# EAGLE design DelayExperiments (EAGLE 7.7.0)
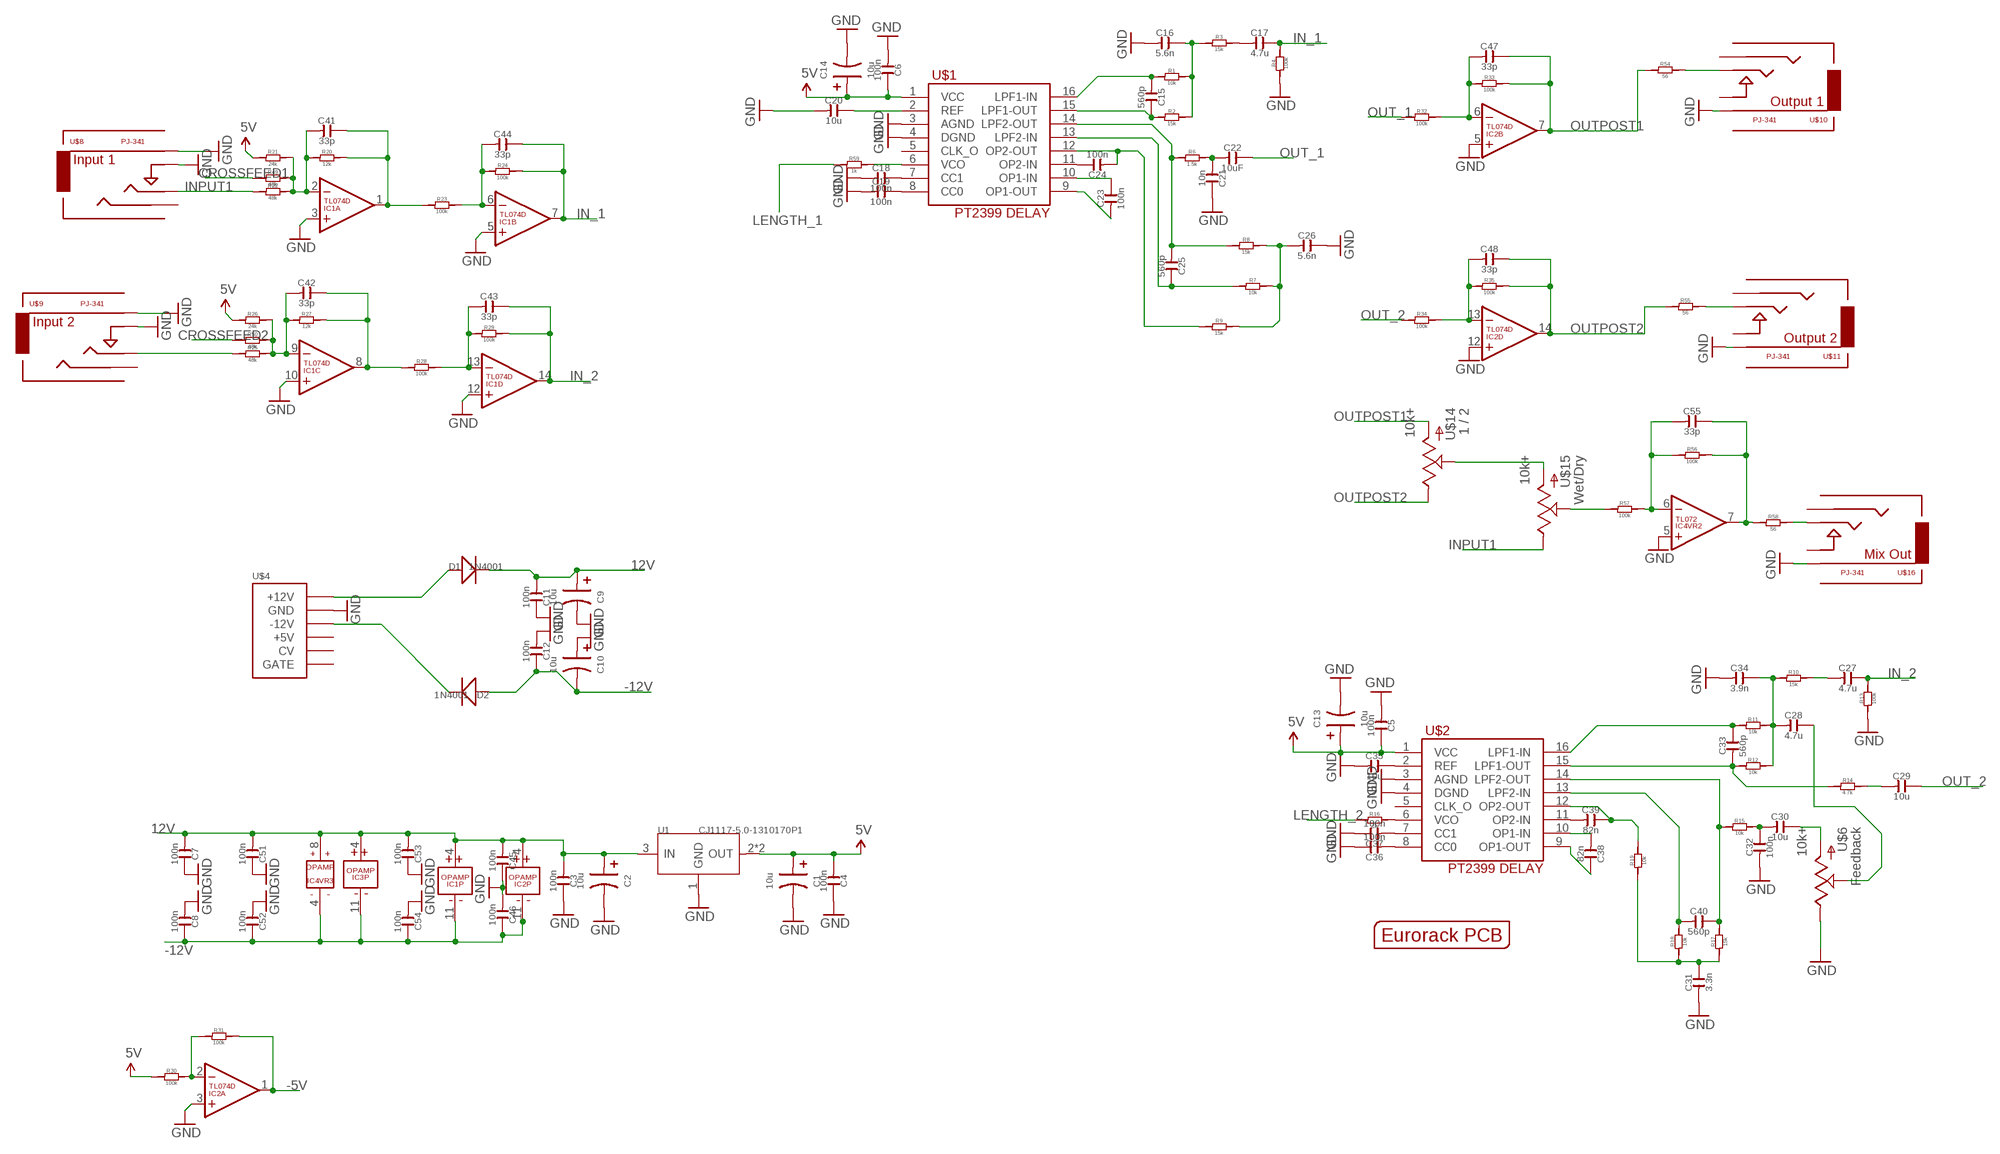
[diagram p0: schematic, sheet 1, part 1 of 2]
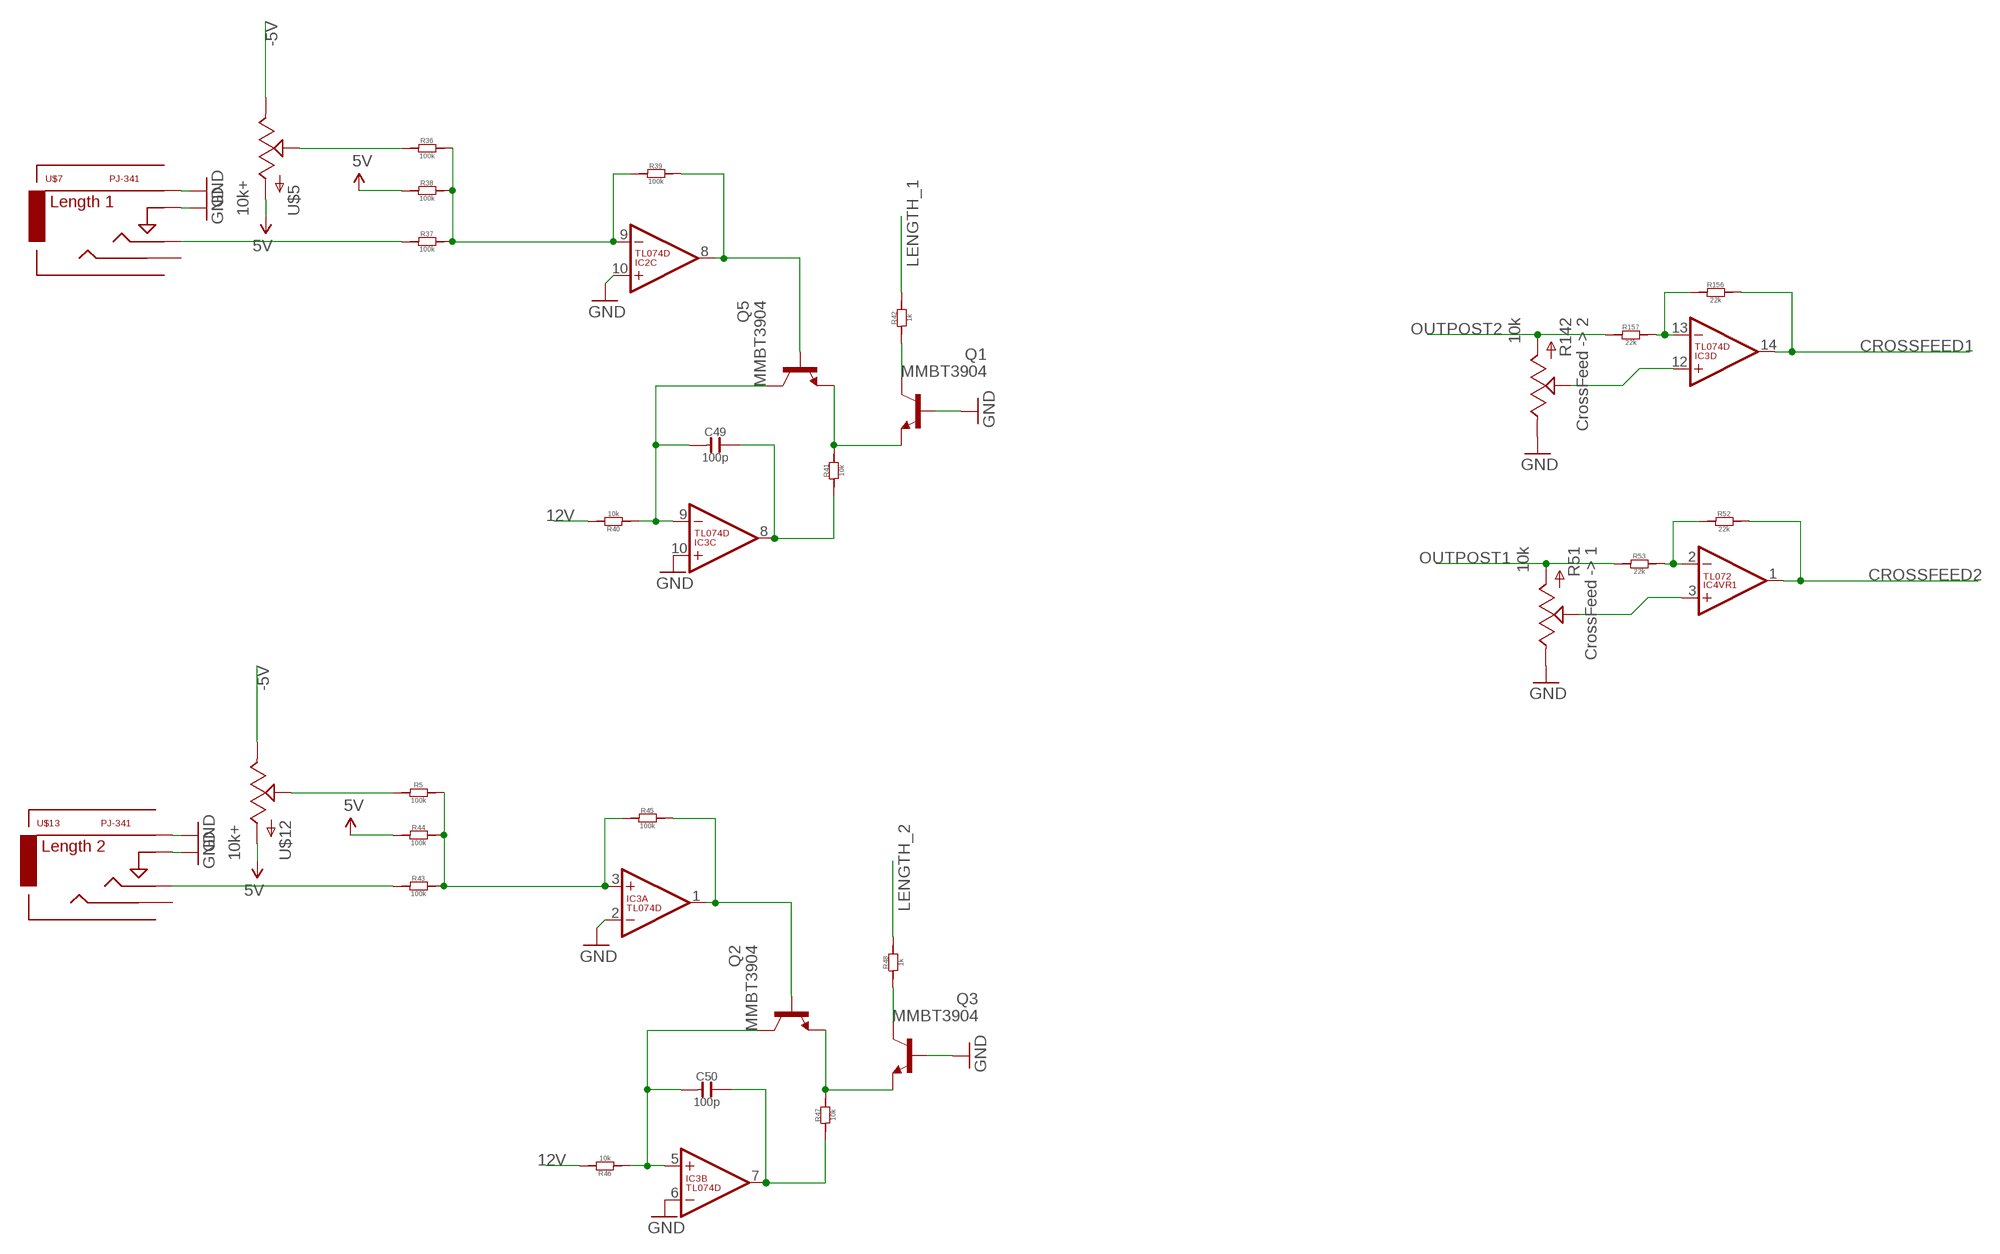
[diagram p1: schematic, sheet 1, part 2 of 2]

## Parts
C1  10u  C-POLAR-A  [CASE-A_3216]
C2  10u  C-POLAR-A  [CASE-A_3216]
C3  100n  C-0603  [C0603]
C4  100n  C-0603  [C0603]
C5  100n  C-0603  [C0603]
C6  100n  C-0603  [C0603]
C7  100n  C-0603  [C0603]
C8  100n  C-0603  [C0603]
C9  10u  C-POLAR-A  [CASE-A_3216]
C10  10u  C-POLAR-A  [CASE-A_3216]
C11  100n  C-0603  [C0603]
C12  100n  C-0603  [C0603]
C13  10u  C-POLAR-A  [CASE-A_3216]
C14  10u  C-POLAR-A  [CASE-A_3216]
C15  560p  C-0603  [C0603]
C16  5.6n  C-0603  [C0603]
C17  4.7u  C-0603  [C0603]
C18  100n  C-0603  [C0603]
C19  100n  C-0603  [C0603]
C20  10u  C-0603  [C0603]
C21  10n  C-0603  [C0603]
C22  10uF  C-0603  [C0603]
C23  100n  C-0603  [C0603]
C24  100n  C-0603  [C0603]
C25  560p  C-0603  [C0603]
C26  5.6n  C-0603  [C0603]
C27  4.7u  C-0603  [C0603]
C28  4.7u  C-0603  [C0603]
C29  10u  C-0603  [C0603]
C30  10u  C-0603  [C0603]
C31  3.3n  C-0603  [C0603]
C32  100n  C-0603  [C0603]
C33  560p  C-0603  [C0603]
C34  3.9n  C-0603  [C0603]
C35  10u  C-0603  [C0603]
C36  100n  C-0603  [C0603]
C37  100n  C-0603  [C0603]
C38  82n  C-0603  [C0603]
C39  82n  C-0603  [C0603]
C40  560p  C-0603  [C0603]
C41  33p  C-0603  [C0603]
C42  33p  C-0603  [C0603]
C43  33p  C-0603  [C0603]
C44  33p  C-0603  [C0603]
C45  100n  C-0603  [C0603]
C46  100n  C-0603  [C0603]
C47  33p  C-0603  [C0603]
C48  33p  C-0603  [C0603]
C49  100p  C-0603  [C0603]
C50  100p  C-0603  [C0603]
C51  100n  C-0603  [C0603]
C52  100n  C-0603  [C0603]
C53  100n  C-0603  [C0603]
C54  100n  C-0603  [C0603]
C55  33p  C-0603  [C0603]
D1  1N4001  D-SOD-123  [SOD123]
D2  1N4001  D-SOD-123  [SOD123]
IC1  TL074D  [SO14]
IC2  TL074D  [SO14]
IC3  TL074D  [SO14]
IC4  TL072  [SO08]
Q1  MMBT3904  MMBT3904LT1-NPN-SOT23-BEC  [SOT23-BEC]
Q2  MMBT3904  MMBT3904LT1-NPN-SOT23-BEC  [SOT23-BEC]
Q3  MMBT3904  MMBT3904LT1-NPN-SOT23-BEC  [SOT23-BEC]
Q5  MMBT3904  MMBT3904LT1-NPN-SOT23-BEC  [SOT23-BEC]
R1  10k  R-0603  [R0603]
R2  15k  R-0603  [R0603]
R3  15k  R-0603  [R0603]
R4  100k  R-0603  [R0603]
R5  100k  R-0603  [R0603]
R6  1.5k  R-0603  [R0603]
R7  10k  R-0603  [R0603]
R8  15k  R-0603  [R0603]
R9  15k  R-0603  [R0603]
R10  15k  R-0603  [R0603]
R11  10k  R-0603  [R0603]
R12  10k  R-0603  [R0603]
R13  100k  R-0603  [R0603]
R14  4.7k  R-0603  [R0603]
R15  10k  R-0603  [R0603]
R16  1k  R-0603  [R0603]
R17  15k  R-0603  [R0603]
R18  10k  R-0603  [R0603]
R19  10k  R-0603  [R0603]
R20  12k  R-0603  [R0603]
R21  24k  R-0603  [R0603]
R22  48k  R-0603  [R0603]
R23  100k  R-0603  [R0603]
R24  100k  R-0603  [R0603]
R25  48k  R-0603  [R0603]
R26  24k  R-0603  [R0603]
R27  12k  R-0603  [R0603]
R28  100k  R-0603  [R0603]
R29  100k  R-0603  [R0603]
R30  100k  R-0603  [R0603]
R31  100k  R-0603  [R0603]
R32  100k  R-0603  [R0603]
R33  100k  R-0603  [R0603]
R34  100k  R-0603  [R0603]
R35  100k  R-0603  [R0603]
R36  100k  R-0603  [R0603]
R37  100k  R-0603  [R0603]
R38  100k  R-0603  [R0603]
R39  100k  R-0603  [R0603]
R40  10k  R-0603  [R0603]
R41  10k  R-0603  [R0603]
R42  1k  R-0603  [R0603]
R43  100k  R-0603  [R0603]
R44  100k  R-0603  [R0603]
R45  100k  R-0603  [R0603]
R46  10k  R-0603  [R0603]
R47  10k  R-0603  [R0603]
R48  1k  R-0603  [R0603]
R49  48k  R-0603  [R0603]
R50  48k  R-0603  [R0603]
R51  10k  POTZEPHPOT  [OG-POTS_ALPS_POT_VERTICAL]
R52  22k  R-0603  [R0603]
R53  22k  R-0603  [R0603]
R54  56  R-0603  [R0603]
R55  56  R-0603  [R0603]
R56  100k  R-0603  [R0603]
R57  100k  R-0603  [R0603]
R58  56  R-0603  [R0603]
R59  1k  R-0603  [R0603]
R142  10k  POTZEPHPOT  [OG-POTS_ALPS_POT_VERTICAL]
R156  22k  R-0603  [R0603]
R157  22k  R-0603  [R0603]
U1  CJ1117-5.0-1310170P1  [SOT223]
U$1  PT2399  [SO16]
U$2  PT2399  [SO16]
U$3  EURORACK_PCB12HP  [EURORACK12HPPCB]
U$4  POWERSHROUDED  [POWER_16_SHROUDED]
U$5  10k+  POTZEPHPOT_BIGKNOB  [OG-POTS_ALPS_POT_VERTICAL_WITHBIGKNOB]
U$6  10k+  POTZEPHPOT  [OG-POTS_ALPS_POT_VERTICAL]
U$7  PJ-341  AUDIO-JACKINPUT  [3.5MM-JACK-SWITCH-13MM-INPUT]
U$8  PJ-341  AUDIO-JACKINPUT  [3.5MM-JACK-SWITCH-13MM-INPUT]
U$9  PJ-341  AUDIO-JACKINPUT  [3.5MM-JACK-SWITCH-13MM-INPUT]
U$10  PJ-341  AUDIO-JACKOUTPUT  [3.5MM-JACK-SWITCH-13MM-OUTPUT]
U$11  PJ-341  AUDIO-JACKOUTPUT  [3.5MM-JACK-SWITCH-13MM-OUTPUT]
U$12  10k+  POTZEPHPOT_BIGKNOB  [OG-POTS_ALPS_POT_VERTICAL_WITHBIGKNOB]
U$13  PJ-341  AUDIO-JACKINPUT  [3.5MM-JACK-SWITCH-13MM-INPUT]
U$14  10k+  POTZEPHPOT  [OG-POTS_ALPS_POT_VERTICAL]
U$15  10k+  POTZEPHPOT  [OG-POTS_ALPS_POT_VERTICAL]
U$16  PJ-341  AUDIO-JACKOUTPUT  [3.5MM-JACK-SWITCH-13MM-OUTPUT]

## Nets
5V [heavypower]: C1.+ C4.1 C5.2 C6.2 C13.+ C14.+ R21.1 R26.1 R30.1 R38.1 R44.1 U1.2(OUT) U1.TER(OUT) U$1.1(VCC) U$2.1(VCC) U$5.P$3(A) U$12.P$3(A)
12V [heavypower]: C2.+ C3.1 C7.1 C9.+ C11.1 C45.1 C51.1 C53.1 D1.- IC1.4(P:V+) IC2.4(P:V+) IC3.4(P:V+) IC4.8(VR3:V+) R40.2 R46.2 U1.3(IN)
-5V: IC2.1(A:OUT) R31.2 U$5.P$1(E) U$12.P$1(E)
-12V [heavypower]: C8.2 C10.- C12.2 C46.2 C52.2 C54.2 D2.+ IC1.11(P:V-) IC2.11(P:V-) IC3.11(P:V-) IC4.4(VR3:V-)
CROSSFEED1: IC3.14(D:OUT) R49.1 R156.2
CROSSFEED2: IC4.1(VR1:OUT) R50.1 R52.2
GND [groundplane]: C1.- C2.- C3.2 C4.2 C5.1 C6.1 C7.2 C8.1 C9.- C10.+ C11.2 C12.1 C13.- C14.- C16.1 C18.1 C19.1 C20.1 C21.2 C26.2 C31.1 C32.1 C34.1 C35.1 C36.2 C37.2 C45.2 C46.1 C51.2 C52.1 C53.2 C54.1 IC1.3(A:+IN) IC1.5(B:+IN) IC1.10(C:+IN) IC1.12(D:+IN) IC2.3(A:+IN) IC2.5(B:+IN) IC2.10(C:+IN) IC2.12(D:+IN) IC3.2(A:-IN) IC3.6(B:-IN) IC3.10(C:+IN) IC4.5(VR2:+IN) Q1.B Q3.B R4.1 R13.1 R51.P$1(E) R142.P$1(E) U1.1(GND) U$1.3(AGND) U$1.4(DGND) U$2.3(AGND) U$2.4(DGND) U$4.3(GND) U$4.4(GND) U$4.5(GND) U$4.6(GND) U$4.7(GND) U$4.8(GND) U$6.P$1(E) U$7.RING@3(RING) U$7.SWITCH@3(SWITCH) U$8.RING@3(RING) U$8.SWITCH@3(SWITCH) U$9.RING@3(RING) U$9.SWITCH@3(SWITCH) U$10.RING@3(RING) U$11.RING@3(RING) U$13.RING@3(RING) U$13.SWITCH@3(SWITCH) U$16.RING@3(RING)
IN_1: C17.2 C44.2 IC1.7(B:OUT) R4.2 R24.2
IN_2: C27.2 C43.2 IC1.14(D:OUT) R13.2 R29.2
INPUT1: R22.1 U$8.TIP@3(TIP) U$15.P$1(E)
LENGTH_1: R42.2 R59.1
LENGTH_2: R16.1 R48.2
N$1 [heavypower]: D1.+ U$4.9(+12V) U$4.10(+12V)
N$2: C15.1 R1.1 U$1.16(LPF1-IN)
N$3: C15.2 R2.1 U$1.15(LPF1-OUT)
N$4: C17.1 R3.2
N$5 [heavypower]: D2.- U$4.1(-12V) U$4.2(-12V)
N$6: C18.2 U$1.7(CC1)
N$7: C16.2 R1.2 R2.2 R3.1
N$8: C19.2 U$1.8(CC0)
N$9: C20.2 U$1.2(REF)
N$10: C21.1 C22.1 R6.2
N$11: R36.1 U$5.P$2(S)
N$12: R5.1 U$12.P$2(S)
N$13: C25.1 R6.1 R8.1 U$1.14(LPF2-OUT)
N$14: C24.2 U$1.11(OP2-IN)
N$15: C23.2 U$1.10(OP1-IN)
N$16: C23.1 U$1.9(OP1-OUT)
N$17: C25.2 R7.1 U$1.13(LPF2-IN)
N$18: C26.1 R7.2 R8.2 R9.2
N$19: C24.1 R9.1 U$1.12(OP2-OUT)
N$20: C28.2 U$6.P$2(S)
N$21: C27.1 R10.2
N$22: C33.1 R12.1 R14.1 U$2.15(LPF1-OUT)
N$23: C33.2 R11.1 U$2.16(LPF1-IN)
N$24: C28.1 C34.2 R10.1 R11.2 R12.2
N$25: C30.2 U$6.P$3(A)
N$26: C29.1 R14.2
N$27: C30.1 C32.2 R15.2
N$28: C40.2 R15.1 R17.2 U$2.14(LPF2-OUT)
N$29: C35.2 U$2.2(REF)
N$30: C36.1 U$2.8(CC0)
N$31: C37.1 U$2.7(CC1)
N$32: R16.2 U$2.6(VCO)
N$33: R37.1 U$7.TIP@3(TIP)
N$34: C38.1 U$2.10(OP1-IN)
N$35: C38.2 U$2.9(OP1-OUT)
N$36: C39.1 U$2.11(OP2-IN)
N$37: C39.2 R19.2 U$2.12(OP2-OUT)
N$38: C40.1 R18.2 U$2.13(LPF2-IN)
N$39: C31.2 R17.1 R18.1 R19.1
N$40: C43.1 IC1.13(D:-IN) R28.2 R29.1
N$41: C44.1 IC1.6(B:-IN) R23.2 R24.1
N$42: C41.1 IC1.2(A:-IN) R20.1 R21.2 R22.2 R49.2
N$43: C41.2 IC1.1(A:OUT) R20.2 R23.1
N$44: IC2.2(A:-IN) R30.2 R31.1
N$45: IC4.2(VR1:-IN) R52.1 R53.2
N$46: C42.2 IC1.8(C:OUT) R27.2 R28.1
N$47: C42.1 IC1.9(C:-IN) R25.2 R26.2 R27.1 R50.2
N$48: R59.2 U$1.6(VCO)
N$49: R25.1 U$9.TIP@3(TIP)
N$50: C47.1 IC2.6(B:-IN) R32.2 R33.1
N$51: C48.1 IC2.13(D:-IN) R34.2 R35.1
N$52: IC2.9(C:-IN) R36.2 R37.2 R38.2 R39.1
N$53: IC2.8(C:OUT) Q5.B R39.2
N$54: C49.1 IC3.9(C:-IN) Q5.C R40.1
N$55: IC4.3(VR1:+IN) R51.P$2(S)
N$56: U$14.P$2(S) U$15.P$3(A)
N$57: Q1.C R42.1
N$58: C49.2 IC3.8(C:OUT) R41.1
N$59: Q1.E Q5.E R41.2
N$60: R43.1 U$13.TIP@3(TIP)
N$61: IC3.3(A:+IN) R5.2 R43.2 R44.2 R45.1
N$62: IC3.1(A:OUT) Q2.B R45.2
N$63: C50.1 IC3.5(B:+IN) Q2.C R46.1
N$64: Q3.C R48.1
N$65: C50.2 IC3.7(B:OUT) R47.1
N$66: Q2.E Q3.E R47.2
N$67: R55.2 U$11.TIP@3(TIP)
N$68: R54.2 U$10.TIP@3(TIP)
N$69: C55.2 IC4.7(VR2:OUT) R56.2 R58.1
N$70: R58.2 U$16.TIP@3(TIP)
N$71: R57.1 U$15.P$2(S)
N$72: IC3.13(D:-IN) R156.1 R157.2
N$73: C55.1 IC4.6(VR2:-IN) R56.1 R57.2
N$78: IC3.12(D:+IN) R142.P$2(S)
OUT_1: C22.2 R32.1
OUT_2: C29.2 R34.1
OUTPOST1: C47.2 IC2.7(B:OUT) R33.2 R51.P$3(A) R53.1 R54.1 U$14.P$3(A)
OUTPOST2: C48.2 IC2.14(D:OUT) R35.2 R55.1 R142.P$3(A) R157.1 U$14.P$1(E)
Unconnected: U$1.5(CLK_O) U$2.5(CLK_O) U$4.11(+5V) U$4.12(+5V) U$4.13(CV) U$4.14(CV) U$4.15(GATE) U$4.16(GATE) U$7.SECOND@3(SECOND) U$8.SECOND@3(SECOND) U$9.SECOND@3(SECOND) U$10.SECOND@3(SECOND) U$10.SWITCH@3(SWITCH) U$11.SECOND@3(SECOND) U$11.SWITCH@3(SWITCH) U$13.SECOND@3(SECOND) U$16.SECOND@3(SECOND) U$16.SWITCH@3(SWITCH)

## Library data of the parts
C1 C2 C9 C10 C13 C14 = EurorackModularParts:C-POLAR*
C3-C8 C11 C12 C15-C55 = OPL:C*
D1 D2 = OPL:D*: DIODE
IC1-IC3 = EurorackModularParts:TL074: OP AMP
IC4 = EurorackModularParts:TL072
Q1-Q3 Q5 = transistor:*-NPN-: NPN Transistror BF959 corrected 2008.03.06; MF: NXP; MPN: PMBT3904,215; OC_FARNELL: 2336795
R1-R50 R52-R59 R156 R157 = OPL:R*
R51 = EurorackModularParts:POT; DESC: CrossFeed -> 1
R142 = EurorackModularParts:POT; DESC: CrossFeed -> 2
U1 = OPL:CJ1117-5.0
U$1 U$2 = EurorackModularParts:PT2399
U$3 = EurorackModularParts:EURORACK_PCB
U$4 = EurorackModularParts:POWER
U$5 U$12 = EurorackModularParts:POT
U$6 = EurorackModularParts:POT; DESC: Feedback
U$7 = EurorackModularParts:AUDIO-JACK: Switching Mono 3.5mm Audio Jack from Erthenvar.; DESC: Length 1; MPN: PJ-341
U$8 = EurorackModularParts:AUDIO-JACK: Switching Mono 3.5mm Audio Jack from Erthenvar.; DESC: Input 1; MPN: PJ-341
U$9 = EurorackModularParts:AUDIO-JACK: Switching Mono 3.5mm Audio Jack from Erthenvar.; DESC: Input 2; MPN: PJ-341
U$10 = EurorackModularParts:AUDIO-JACK: Switching Mono 3.5mm Audio Jack from Erthenvar.; DESC: Output 1; MPN: PJ-341
U$11 = EurorackModularParts:AUDIO-JACK: Switching Mono 3.5mm Audio Jack from Erthenvar.; DESC: Output 2; MPN: PJ-341
U$13 = EurorackModularParts:AUDIO-JACK: Switching Mono 3.5mm Audio Jack from Erthenvar.; DESC: Length 2; MPN: PJ-341
U$14 = EurorackModularParts:POT; DESC: 1 / 2
U$15 = EurorackModularParts:POT; DESC: Wet/Dry
U$16 = EurorackModularParts:AUDIO-JACK: Switching Mono 3.5mm Audio Jack from Erthenvar.; DESC: Mix Out; MPN: PJ-341

## Net classes
0 default: width 0.254 mm
1 heavypower: width 0.381 mm
3 groundplane: width 0.279 mm

## Board
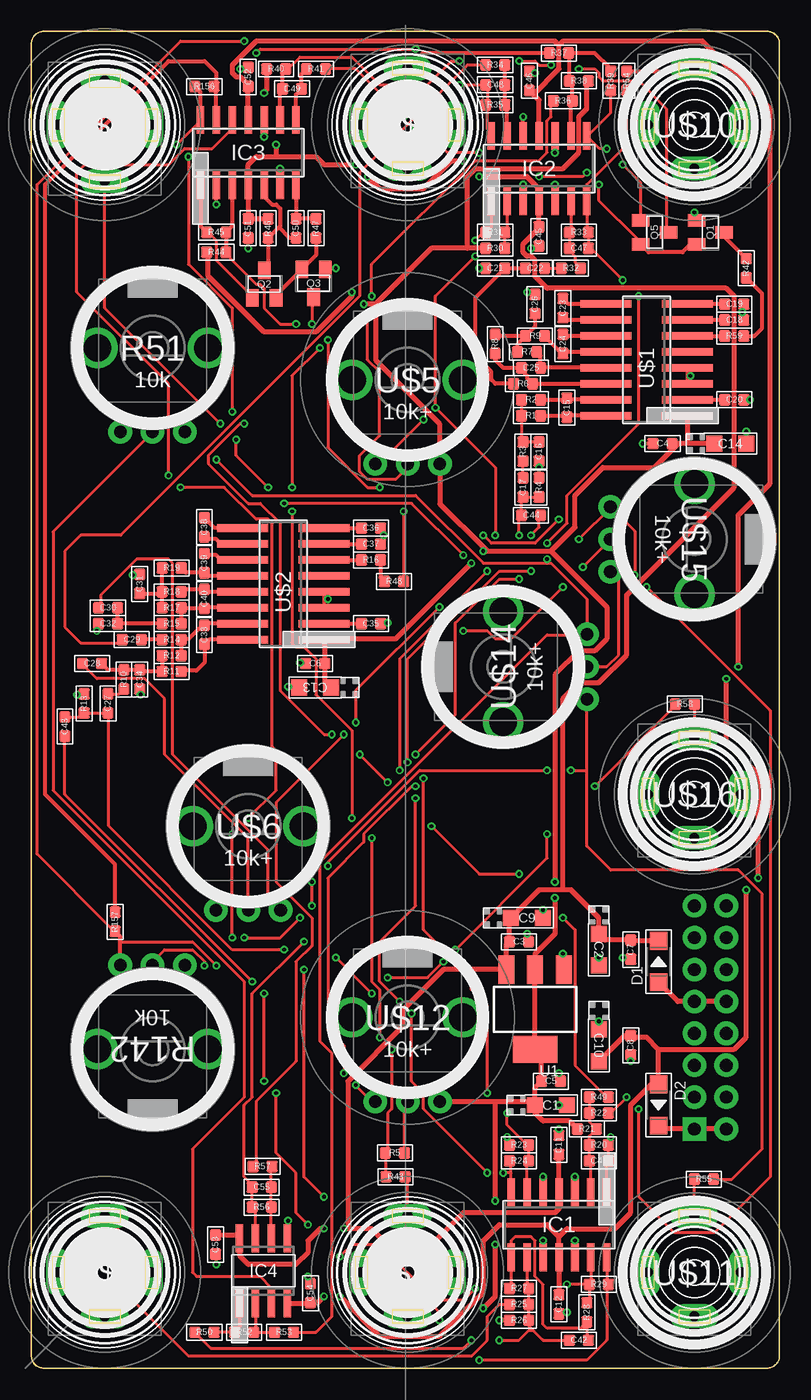
[diagram p2: board, top side]
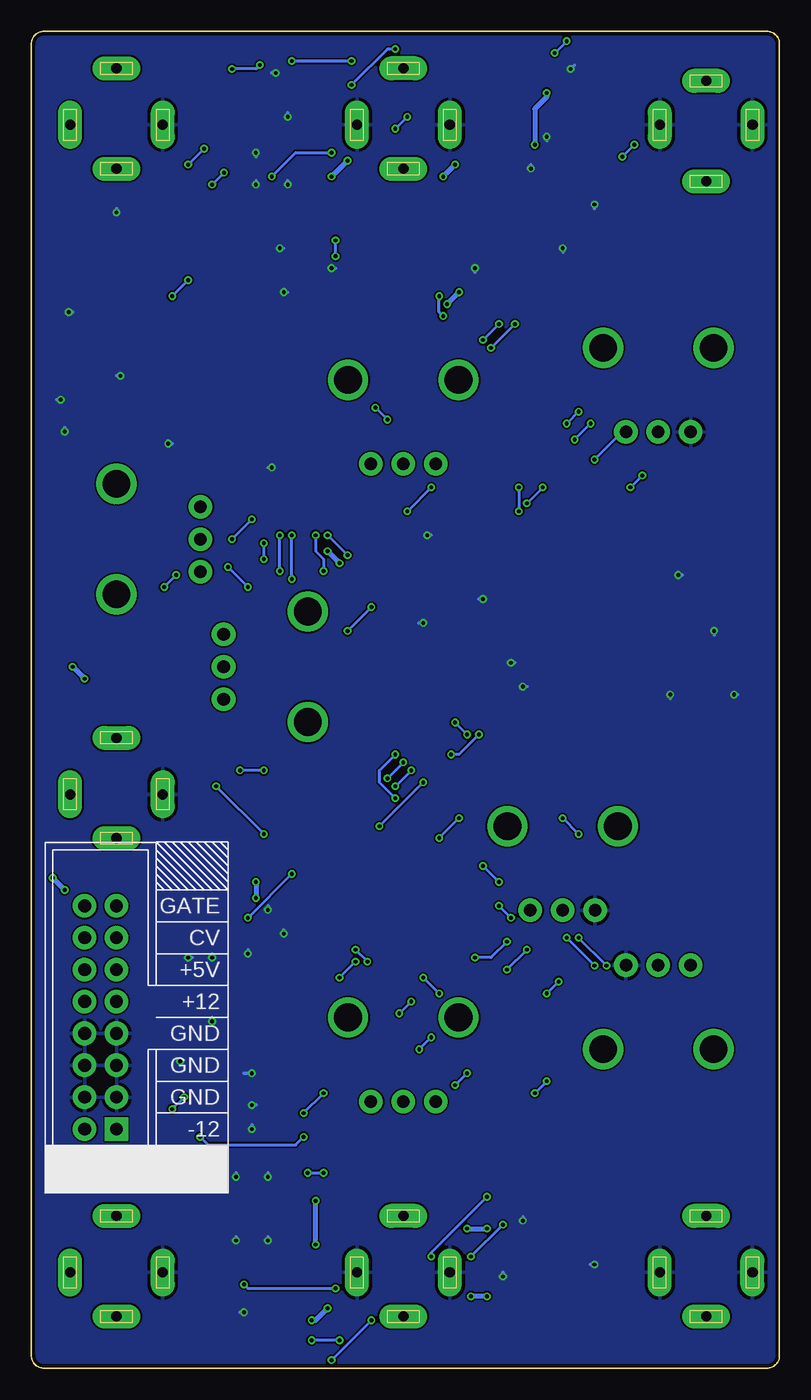
[diagram p3: board, bottom side, seen from below]

Size 59.62 x 106.5 mm. Coordinates in mm from the lower left corner, seen from the top.
Copper layers (1*16): Top 0.035mm / dielectric 1.5mm / Bottom 0.035mm
Design rules "dirt_cheap_dirty_boards.v1": minimum track width 5mil, minimum drill 12mil, track to track 5mil, track to pad 5mil, pad to pad 5mil, via to via 5mil, smd to smd 0mil, copper to edge 10mil, drill to drill 10mil, minimum pad ring 10mil, minimum via ring 6mil, stop-mask expansion 2mil, vias tented up to drill 25mil, thermal gap 10mil

### Footprints (pad centres in the part's own frame; a part is rotated, then mirrored left to right if it is on the bottom)
CASE-A_3216 = smd 1.27 x 1.27: + -1.27,0; - 1.27,0
C0603 = smd 0.889 x 0.889: 1 -0.762,0; 2 0.762,0
SOD123 = smd 1.397 x 1.397: + -1.651,0; - 1.651,0
SO14 = smd 0.6 x 2.2: 1 -3.81,-2.6; 2 -2.54,-2.6; 3 -1.27,-2.6; 4 0,-2.6; 5 1.27,-2.6; 6 2.54,-2.6; 7 3.81,-2.6; 8 3.81,2.6; 9 2.54,2.6; 10 1.27,2.6; 11 0,2.6; 12 -1.27,2.6; 13 -2.54,2.6; 14 -3.81,2.6
SO08 = smd 0.6 x 2.2: 1 -1.905,-2.6; 2 -0.635,-2.6; 3 0.635,-2.6; 4 1.905,-2.6; 5 1.905,2.6; 6 0.635,2.6; 7 -0.635,2.6; 8 -1.905,2.6
SOT23-BEC = smd 1 x 1.4: B -0.95,-1.1; C 0,1.1; E 0.95,-1.1
R0603 = smd 0.889 x 0.889: 1 -0.762,0; 2 0.762,0
OG-POTS_ALPS_POT_VERTICAL = drill 1 pad 1.88: P$1 -2.58,-6.7; P$2 0,-6.7; P$3 2.58,-6.7 | drill 2.2 pad 3.175: P$4 4.4,0; P$5 -4.4,0
SOT223 = smd 1.27 x 2.286: 1 -2.286,-3.175; 2 0,-3.175; 3 2.286,-3.175 | smd 3.556 x 2.159: TER 0,3.175
SO16 = smd 0.6 x 4.064: 1 -4.445,-3.235; 2 -3.175,-3.235; 3 -1.905,-3.235; 4 -0.635,-3.235; 5 0.635,-3.235; 6 1.905,-3.235; 7 3.175,-3.235; 8 4.445,-3.235; 9 4.445,3.235; 10 3.175,3.235; 11 1.905,3.235; 12 0.635,3.235; 13 -0.635,3.235; 14 -1.905,3.235; 15 -3.175,3.235; 16 -4.445,3.235
POWER_16_SHROUDED = drill 1.016 pad 1.88 square: 1 -8.89,-1.27 | drill 1.016 pad 1.88: 2 -8.89,1.27; 3 -6.35,-1.27; 4 -6.35,1.27; 5 -3.81,-1.27; 6 -3.81,1.27; 7 -1.27,-1.27; 8 -1.27,1.27; 9 1.27,-1.27; 10 1.27,1.27; 11 3.81,-1.27; 12 3.81,1.27; 13 6.35,-1.27; 14 6.35,1.27; 15 8.89,-1.27; 16 8.89,1.27
OG-POTS_ALPS_POT_VERTICAL_WITHBIGKNOB = drill 1 pad 1.88: P$1 -2.58,-6.7; P$2 0,-6.7; P$3 2.58,-6.7 | drill 2.2 pad 3.175: P$4 4.4,0; P$5 -4.4,0
3.5MM-JACK-SWITCH-13MM-INPUT = drill 0.8 pad 1.93 long: RING@3 -3.7,0; SECOND@3 0,-3.5; SWITCH@3 3.7,0; TIP@3 0,4.5
3.5MM-JACK-SWITCH-13MM-OUTPUT = drill 0.8 pad 1.93 long: RING@3 -3.7,0; SECOND@3 0,-3.5; SWITCH@3 3.7,0; TIP@3 0,4.5

### Placement (x,y rotation side)
C1  41.41,20.95 0 top
C2  45.22,33.34 270 top
C3  38.87,33.97 0 top
C4  50.3,73.66 180 top
C5  41.41,22.86 180 top
C6  22.61,56.13 0 top
C7  47.76,33.34 270 top
C8  47.76,25.72 90 top
C9  39.51,35.88 0 top
C10  45.22,25.72 270 top
C11  42.05,17.78 90 top
C12  42.05,5.08 90 top
C13  22.61,54.23 180 top
C14  55.7,73.66 0 top
C15  42.68,76.52 90 top
C16  40.46,73.03 90 top
C17  39.19,70.17 270 top
C18  56.02,83.5 180 top
C19  56.02,84.77 180 top
C20  56.02,77.15 180 top
C21  36.97,87.63 180 top
C22  40.14,87.63 0 top
C23  42.36,84.45 270 top
C24  42.36,81.6 90 top
C25  39.82,79.69 0 top
C26  40.14,84.77 90 top
C27  6.1,52.96 270 top
C28  4.83,56.13 180 top
C29  8.01,58.04 180 top
C30  6.1,60.58 180 top
C31  8.64,62.48 270 top
C32  6.1,59.31 0 top
C33  13.79,58.42 270 top
C34  8.64,54.86 90 top
C35  27.06,59.31 180 top
C36  27.06,66.93 0 top
C37  27.06,65.66 0 top
C38  13.79,66.99 90 top
C39  13.79,64.14 270 top
C40  13.79,61.28 270 top
C41  45.22,16.51 0 top
C42  43.63,2.22 0 top
C43  2.67,51.12 90 top
C44  39.82,67.94 180 top
C45  40.46,90.17 270 top
C46  39.7,102.55 270 top
C47  43.63,89.22 0 top
C48  36.97,102.23 180 top
C49  20.77,101.92 0 top
C50  21.09,90.81 90 top
C51  17.28,90.81 270 top
C52  17.28,102.87 270 top
C53  14.68,9.84 270 top
C54  22.23,5.97 270 top
C55  18.36,14.41 180 top
D1  49.98,32.38 90 top
D2  49.98,20.95 270 top
IC1  42.05,11.43 180 top
IC2  40.46,95.57 0 top
IC3  17.28,96.84 0 top
IC4  18.49,7.75 0 top
Q1  54.11,90.49 270 top
Q2  18.55,86.36 0 top
Q3  22.49,86.42 180 top
Q5  49.66,90.49 270 top
R1  39.82,75.88 180 top
R2  39.82,77.15 180 top
R3  39.19,73.03 270 top
R4  40.46,70.17 270 top
R5  28.96,17.14 180 top
R6  39.19,78.42 180 top
R7  39.51,80.96 180 top
R8  36.97,81.6 90 top
R9  40.14,82.23 180 top
R10  7.37,54.86 270 top
R11  11.18,55.5 180 top
R12  11.18,56.77 180 top
R13  4.2,52.96 270 top
R14  11.18,58.04 180 top
R15  11.18,59.31 180 top
R16  27.06,64.39 180 top
R17  11.18,60.58 0 top
R18  11.18,61.85 0 top
R19  11.18,63.75 0 top
R20  45.22,17.78 0 top
R21  44.27,19.05 0 top
R22  45.22,20.32 180 top
R23  38.87,17.78 0 top
R24  38.87,16.51 180 top
R25  38.87,5.08 0 top
R26  38.87,3.81 0 top
R27  38.87,6.35 180 top
R28  44.27,4.45 90 top
R29  45.22,6.67 0 top
R30  36.97,89.22 0 top
R31  36.97,90.49 180 top
R32  43,87.63 0 top
R33  43.63,90.49 0 top
R34  36.97,103.82 0 top
R35  36.97,100.65 180 top
R36  42.36,100.97 0 top
R37  42.05,104.78 0 top
R38  43.63,102.55 180 top
R39  46.17,102.55 270 top
R40  19.5,103.5 180 top
R41  22.68,103.5 0 top
R42  56.97,87.63 270 top
R43  29.03,15.24 180 top
R44  14.74,88.9 0 top
R45  14.74,90.49 180 top
R46  18.87,90.81 90 top
R47  22.68,90.81 270 top
R48  28.9,62.67 180 top
R49  45.22,21.59 180 top
R50  13.79,2.86 180 top
R51  9.66,81.28 0 top
R52  16.96,2.86 180 top
R53  20.14,2.86 180 top
R54  47.44,102.55 90 top
R55  53.6,15.05 180 top
R56  18.36,12.83 180 top
R57  18.42,16.07 0 top
R58  52.08,52.9 0 top
R59  56.02,82.23 180 top
R142  9.66,25.4 180 top
R156  13.79,102.11 180 top
R157  6.68,35.56 90 top
U1  40.14,28.57 180 top
U$1  49.03,80.33 90 top
U$2  20.07,62.48 90 top
U$3  -0.5,0 0 top
U$4  54.11,27.94 90 bottom
U$5  29.98,78.74 0 top
U$6  17.28,43.18 0 top
U$7  29.98,99.06 0 top
U$8  5.85,99.06 180 top
U$9  5.85,7.62 0 top
U$10  52.84,99.06 0 top
U$11  52.84,7.62 0 top
U$12  29.98,27.94 0 top
U$13  29.98,7.62 0 top
U$14  37.6,55.88 90 top
U$15  52.84,66.04 270 top
U$16  52.84,45.72 0 top

### Tracks (layer width: path | path; a pad name or v marks a point on that pad's centre or on a via)
5V  (via drill 0.3)
  Top 0.381: C1.+ 40.14,22.35 C5.2 40.65,24.89 U1.TER U1.2 40.14,33.02 41.73,34.61 v41.73,37.47 | C14.+ 52.2,73.66 | 52.2,73.66 51.57,73.66 | 51.57,73.66 C4.1 | U$1.1 52.27,73.72 52.2,73.66 | 23.38,57.97 23.38,57.78 | 23.38,57.78 C6.2 23.38,54.74 C13.+ | R21.1 42.87,19.68 40.77,19.68 40.14,20.32 C1.+ | U$12.P$3 36.97,21.24 | 36.97,21.24 39.85,21.24 C1.+ | R26.1 v37.28,3.81 | v36.01,4.76 36.97,5.71 v36.97,9.84 | v36.97,13.34 36.97,21.24 | 36.01,65.41 32.56,68.86 U$5.P$3 32.52,72.07 32.52,75.25 27.44,80.33 27.44,84.77 | 36.01,65.41 36.33,65.09 41.41,65.09 | 41.41,65.09 43.31,66.99 43.31,69.53 45.54,71.75 49.66,71.75 51.57,73.66 | 23.38,57.78 23.31,57.78 U$2.1 23.31,58.1 29.03,58.1 v35.06,64.14 | 36.01,65.41 v36.01,65.09 | v25.54,85.72 25.54,85.41 22.68,82.55 18.55,82.55 14.11,87 14.11,88.9 R44.1 | 27.44,84.77 v26.49,84.77 | 27.44,84.77 31.88,89.22 34.74,89.22 | R30.1 34.74,89.22 | 34.74,89.22 34.74,94.93 35.38,95.57 42.36,95.57 43.63,96.84 43.63,99.69 44.27,100.33 44.27,102.55 R38.1 | v41.73,38.73 41.73,55.24 43.63,57.15 44.9,57.15 45.85,58.1 45.85,60.64 41.41,65.09
  Bottom 0.381: v37.28,3.81 36.97,3.81 v36.01,4.76 | v36.97,9.84 v36.97,13.34 | v36.01,65.09 v35.06,64.14 | v26.49,84.77 v25.54,85.72 | v41.73,38.73 v41.73,37.47
12V  (via drill 0.3)
  Top 0.381: D1.- 47.82,34.04 C7.1 45.73,34.1 C2.+ 45.22,35.88 43,38.1 42.36,38.1 | C11.1 IC1.4 42.05,12.7 41.73,12.38 34.42,12.38 32.2,10.16 28.07,10.16 27.12,11.11 25.22,11.11 | C53.1 16.32,10.6 IC4.8 16.64,10.28 16.64,8.89 17.28,8.26 21.09,8.26 22.04,9.21 22.04,10.16 23,11.11 v23.31,11.11 | 42.36,38.1 40.46,38.1 C9.+ 38.11,35.75 C3.1 37.85,33.72 U1.3 32.84,31.75 29.66,28.57 29.66,27.3 25.22,22.86 25.22,11.11 | 25.22,11.11 v24.9,11.11 | R46.2 C51.1 IC3.4 17.28,95.89 17.91,96.52 19.5,96.52 | 19.5,96.52 22.68,96.52 23.31,95.89 v25.85,95.89 | R40.2 18.74,101.79 v18.55,101.6 | v19.5,97.47 19.5,96.52 | v35.7,94.93 39.51,94.93 40.46,93.98 IC2.4 C45.1 40.46,90.81 39.19,89.53 39.19,88.9 39.51,88.58 39.82,88.58 40.14,88.27 40.14,87 41.09,86.04 55.38,86.04 56.02,85.41 56.02,70.17 47.44,61.59 47.44,56.83 45.22,54.61 43.63,54.61 42.36,53.34 42.36,38.1 | v34.42,96.2 33.47,96.2 31.25,93.98 27.76,93.98 v26.8,94.93
  Bottom 0.381: v24.9,11.11 v23.31,11.11 | v18.55,101.6 18.55,101.28 19.5,100.33 v19.5,97.47 | v34.42,96.2 v35.7,94.93 | v25.85,95.89 v26.8,94.93
-5V  (via drill 0.3)
  Top 0.254: IC2.1 36.65,90.93 R31.2 36.01,90.49 v35.38,89.85 | v35.38,88.58 32.2,85.41 v32.2,76.52 36.97,71.75 v36.97,66.36 | v31.25,75.56 27.44,71.75 U$5.P$1 | v25.85,22.54 27.12,21.27 U$12.P$1 | v24.9,23.5 24.9,25.72 23.63,26.99 23.63,39.05 26.49,41.91 26.49,42.55 30.3,46.35 v30.61,46.35 | v29.34,47.62 29.34,56.52 v36.33,63.5
  Bottom 0.254: v35.38,88.58 v35.38,89.85 | v31.25,75.56 v32.2,76.52 | v24.9,23.5 v25.85,22.54 | v29.34,47.62 v30.61,46.35 | v36.33,63.5 36.33,64.45 36.97,65.09 v36.97,66.36
-12V  (via drill 0.3)
  Top 0.381: D2.+ 49.98,23.18 | 49.98,23.18 49.98,25.4 | 49.98,25.4 49.03,26.35 47.89,26.35 C8.2 47.25,26.48 C10.- | IC3.11 C52.2 17.28,102.23 16.64,102.87 16.33,102.87 16.01,103.19 16.01,103.82 17.91,105.73 41.73,105.73 42.05,105.41 | IC2.11 40.46,101.03 40.01,101.47 | 40.01,101.47 C46.2 | IC4.4 22.17,5.15 C54.2 22.8,5.21 v23.31,5.71 | C12.2 IC1.11 42.05,10.48 | 42.05,10.48 42.68,11.11 46.49,11.11 47.76,12.38 47.76,20.95 49.98,23.18 | v24.58,5.71 27.76,2.54 32.52,2.54 36.01,6.03 36.01,10.16 37.28,11.43 41.09,11.43 42.05,10.48 | 42.05,105.41 42.05,103.5 40.01,101.47 | 42.05,105.41 42.36,105.73 53.48,105.73 58.87,100.33 58.87,70.48 56.33,67.94 v56.33,55.88 | v55.38,54.93 55.38,49.85 57.92,47.31 v57.92,39.05 | v56.97,38.1 56.97,26.35 56.02,25.4 49.98,25.4
  Bottom 0.381: v23.31,5.71 v24.58,5.71 | v55.38,54.93 v56.33,55.88 | v56.97,38.1 v57.92,39.05
CROSSFEED1  (via drill 0.3)
  Top 0.254: v42.36,35.88 43.31,34.92 43.31,24.13 45.85,21.59 R49.1 | v38.87,39.37 35.7,39.37 v31.88,43.18 | v26.17,48.9 v28.39,46.67 | v23.95,50.48 23.31,50.48 19.82,53.98 19.82,67.31 18.23,68.9 17.28,68.9 14.11,72.07 14.11,72.71 16.64,75.25 v16.96,75.25 | v16.01,76.2 16.01,84.45 12.52,87.95 v12.52,96.52 | v11.56,97.47 13.47,99.38 IC3.14
  Top 0.305: IC3.14 13.47,101.66 R156.2
  Bottom 0.254: v38.87,39.37 v42.36,35.88 | v28.39,46.67 v31.88,43.18 | v26.17,48.9 25.54,48.9 v23.95,50.48 | v16.01,76.2 v16.96,75.25 | v11.56,97.47 v12.52,96.52
CROSSFEED2
  Top 0.254: IC4.1 16.58,3.24 R52.2 R50.1
GND  (via drill 0.3)
  Top 0.279: 8.64,63.56 C31.1 v8.07,63.18 | IC3.10 v18.55,98.11 | IC3.6 v19.82,95.57 | IC3.2 v14.74,92.71 | C51.2 v17.28,89.22 | Q3.B v24.27,87.63 | C46.1 v40.14,103.19 | IC2.10 v41.73,96.84 | IC2.5 v41.73,94.3 | IC2.3 v39.19,94.3 | Q1.B v52.84,92.08 | C18.1 v56.65,84.14 C19.1 | U$1.3 52.27,79.04 | 52.27,79.04 U$1.4 | 52.27,79.04 v52.52,79.06 | C20.1 v57.28,77.15 | C26.2 v39.51,85.72 | C21.2 v35.7,87.63 | C45.2 v39.82,89.22 | C14.- v56.97,74.61 | C4.2 v48.71,73.66 | C16.1 v40.46,71.75 R4.1 | C13.- v20.45,54.29 | C6.1 v21.41,56.2 | C35.1 v28.39,59.37 | C37.2 v28.07,66.36 C36.2 | U$2.4 23.31,61.28 | 23.31,61.28 U$2.3 | 23.31,61.28 v23.63,61.28 | C32.1 5.34,58.86 v5.21,58.74 | C34.1 8.64,53.72 v8.71,53.66 | R13.1 3.69,53.72 v3.63,53.66 | C9.- v40.77,36.51 | C3.2 39.63,34.48 v39.51,34.61 | U1.1 42.43,32.96 v42.36,33.02 | C2.- v45.22,32.7 | C7.2 47.25,32.58 v47.12,32.7 | C8.1 v47.76,24.45 | C10.+ v45.22,27.62 | C5.1 42.17,23.37 v42.05,23.5 | C1.- v42.05,20.95 | C11.2 v42.05,19.05 | IC1.5 v40.77,15.24 | IC1.3 v43.31,15.24 | IC1.10 v40.77,10.16 | IC1.12 v43.31,10.16 | C12.1 42.55,4.32 v42.68,4.45 | C53.2 14.74,9.02 v14.74,8.26 | IC4.5 20.39,11.68 v20.45,11.75 | C54.1 22.23,7.11 v22.04,7.3 | C52.1 16.77,103.63 v16.64,103.5
  Top 0.305: IC2.12 v39.19,99.69
  Bottom 0.279: v18.55,98.11 18.55,97.79 | v19.82,95.57 19.82,95.89 | v14.74,92.71 14.74,92.39 | v17.28,89.22 17.28,88.9 | v24.27,87.63 24.27,87.31 | v39.19,99.69 39.19,100.01 | v40.14,103.19 40.46,103.19 | v41.73,96.84 41.73,96.52 | v41.73,94.3 41.73,94.61 | v39.19,94.3 39.19,94.61 | v52.84,92.08 52.84,92.39 | v56.65,84.14 56.33,84.14 | v52.52,79.06 52.84,79.06 | v57.28,77.15 57.6,77.15 | v39.51,85.72 39.19,85.72 | v35.7,87.63 35.38,87.63 | v39.82,89.22 39.51,89.22 | v56.97,74.61 56.97,74.93 | v48.71,73.66 48.4,73.66 | v40.46,71.75 40.77,71.75 | v20.45,54.29 20.14,54.29 | v21.41,56.2 21.09,56.2 | v28.39,59.37 28.71,59.37 | v28.07,66.36 27.76,66.36 | v23.63,61.28 23.95,61.28 | v8.07,63.18 7.76,63.18 | v5.21,58.74 5.21,58.42 | v8.71,53.66 8.71,53.34 | v3.63,53.66 3.31,53.66 | v40.77,36.51 40.77,36.83 | v39.51,34.61 39.51,34.92 | v42.36,33.02 42.36,33.34 | v45.22,32.7 45.22,33.02 | v47.12,32.7 46.81,32.7 | v47.76,24.45 47.76,24.13 | v45.22,27.62 45.22,27.94 | v42.05,23.5 42.68,23.5 | v42.05,20.95 41.73,20.95 | v42.05,19.05 42.05,19.37 | v40.77,15.24 40.77,15.56 | v43.31,15.24 43.31,15.56 | v40.77,10.16 40.77,10.48 | v43.31,10.16 43.31,10.48 | v42.68,4.45 43,4.45 | v14.74,8.26 15.06,8.26 | v20.45,11.75 20.45,12.06 | v22.04,7.3 22.04,7.62 | v16.64,103.5 16.33,103.82
  pour Bottom: -3.04,109.22 63,109.22 63,-3.49 -3.67,-3.49 -3.67,108.58
IN_1  (via drill 0.3)
  Top 0.254: IC1.7 38.23,15.56 | 38.23,15.56 38.23,16.38 R24.2 | R4.2 C17.2 39.06,69.28 C44.2 38.87,67.94 v38.87,66.36 | v38.87,62.87 37.28,62.87 33.79,59.37 33.79,52.07 v30.61,48.9 | v30.61,45.4 30.61,36.83 27.76,33.97 27.76,30.8 v29.34,29.21 | v30.3,28.26 30.3,22.86 31.25,21.91 31.25,20.64 v36.33,15.56 | 38.23,15.56 v37.6,15.56
  Bottom 0.254: v38.87,62.87 v38.87,66.36 | v30.61,48.9 31.88,47.62 31.88,46.67 v30.61,45.4 | v30.3,28.26 v29.34,29.21 | v37.6,15.56 v36.33,15.56
IN_2  (via drill 0.3)
  Top 0.254: IC1.14 45.85,6.79 R29.2 45.85,6.67 45.85,2.22 44.27,0.64 v35.7,0.64 | C43.2 3.88,51.88 R13.2 C27.2 6.17,52.07 6.17,43.18 16.01,33.34 v20.14,33.34 | v21.73,31.75 21.73,15.24 v23.31,13.65 | v27.76,8.89 31.25,5.4 31.57,5.4 32.52,4.45 v32.52,3.81
  Bottom 0.254: v21.73,31.75 v20.14,33.34 | v23.31,13.65 27.76,9.21 v27.76,8.89 | v35.7,0.64 v32.52,3.81
INPUT1  (via drill 0.3)
  Top 0.254: v47.44,21.59 46.17,20.32 R22.1 | v48.4,20.64 48.4,13.65 51.25,10.79 54.43,10.79 58.87,15.24 58.87,52.39 v49.03,62.23 | v48.08,63.18 48.08,66.67 46.17,68.58 | U$8.TIP@3 5.85,84.45 v15.06,75.25 | v16.33,73.98 16.33,72.71 v18.87,70.17 | v20.14,68.9 30.3,68.9 v34.42,64.77 | v36.01,66.36 36.65,65.72 40.14,65.72 v42.05,67.63 | 46.17,68.58 v43.63,66.04 | 46.17,68.58 U$15.P$1
  Bottom 0.254: v48.4,20.64 v47.44,21.59 | v48.08,63.18 v49.03,62.23 | v16.33,73.98 v15.06,75.25 | v20.14,68.9 v18.87,70.17 | v36.01,66.36 v34.42,64.77 | v43.63,66.04 v42.05,67.63
LENGTH_1
  Top 0.305: R59.1 57.6,82.23 58.24,82.87 58.24,85.6 R42.2
LENGTH_2
  Top 0.305: R16.1 27.82,62.99 R48.2
N$1
  Top 0.381: U$4.10 U$4.9 51.51,29.21 D1.+
N$2
  Top 0.305: U$1.16 42.81,75.88 C15.1 42.55,75.88 R1.1
N$3
  Top 0.305: U$1.15 42.81,77.15 C15.2 42.55,77.15 R2.1
N$4
  Top 0.254: C17.1 R3.2
N$5
  Top 0.381: U$4.2 U$4.1 50.24,19.05 D2.-
N$6
  Top 0.305: C18.2 U$1.7
N$7
  Top 0.254: C16.2 R3.1 39.06,73.91 R1.2 R2.2
N$8
  Top 0.305: C19.2 U$1.8
N$9
  Top 0.305: U$1.2 C20.2
N$10
  Top 0.305: R6.2 36.97,78.42 36.65,78.74 36.65,79.38 35.38,80.64 35.38,85.28 C21.1 C22.1
N$11  (via drill 0.3)
  Top 0.254: v27.12,85.41 27.12,87.95 35.38,96.2 40.46,96.2 41.09,96.84 41.09,99.38 41.41,99.69 41.41,100.97 R36.1 | v26.8,83.82 26.8,80.33 27.76,79.38 27.76,74.3 26.17,72.71 26.17,71.44 26.8,70.8 29.03,70.8 29.98,71.75 U$5.P$2
  Bottom 0.254: v27.12,85.41 27.12,84.14 v26.8,83.82
N$12
  Top 0.254: R5.1 29.73,20.99 U$12.P$2
N$13
  Top 0.305: R8.1 36.97,80.33 37.6,79.69 C25.1 39.06,79.5 39.51,79.06 39.51,78.87 R6.1 U$1.14 46.49,78.42
N$14
  Top 0.305: U$1.11 42.49,82.23 C24.2
N$15
  Top 0.305: U$1.10 42.55,83.5 C23.2
N$16
  Top 0.305: U$1.9 42.81,84.77 C23.1
N$17
  Top 0.305: U$1.13 C25.2 40.58,80.64 R7.1
N$18
  Top 0.305: R9.2 37.09,82.23 R8.2 | C26.1 40.14,83 R9.2 | R7.2 38.74,81.6 R9.2
N$19
  Top 0.305: U$1.12 42.49,80.96 C24.1 42.3,80.83 R9.1
N$20
  Top 0.254: U$6.P$2 17.28,42.23 10.61,48.9 10.61,53.34 9.03,54.93 5.21,54.93 4.26,55.88 C28.2
N$21
  Top 0.254: C27.1 6.99,53.72 R10.2
N$22
  Top 0.305: U$2.15 13.91,59.31 C33.1 13.6,59.18 12.52,58.1 12.01,58.1 R14.1 R12.1
N$23
  Top 0.305: U$2.16 14.17,58.04 C33.2 13.79,56.2 13.15,55.56 12.01,55.56 R11.1
N$24
  Top 0.305: R12.2 R11.2 8.77,55.5 C34.2 R10.1 6.1,55.63 C28.1
N$25
  Top 0.254: C30.2 5.53,60.64 5.53,61.59 8.39,64.45 10.93,64.45 11.25,64.14 11.25,48.9 18.87,41.27 18.87,37.47 19.82,36.51 U$6.P$3
N$26
  Top 0.305: R14.2 C29.1
N$27
  Top 0.305: R15.2 C32.2 C30.1
N$28
  Top 0.305: U$2.14 13.85,60.58 C40.2 12.01,60.52 R17.2 R15.1
N$29
  Top 0.305: U$2.2 C35.2
N$30
  Top 0.305: U$2.8 C36.1
N$31
  Top 0.305: U$2.7 C37.1
N$32
  Top 0.305: U$2.6 R16.2
N$33
  Top 0.305: R37.1 31.2,104.78 U$7.TIP@3
N$34
  Top 0.305: U$2.10 15.12,65.66 14.74,66.04 13.98,66.04 C38.1
N$35
  Top 0.305: U$2.9 14.61,66.93 C38.2
N$36
  Top 0.305: U$2.11 15.12,64.39 14.74,64.77 13.91,64.77 C39.1
N$37
  Top 0.305: U$2.12 14.04,63.12 C39.2 12.33,63.37 R19.2
N$38
  Top 0.305: U$2.13 13.98,61.85 C40.1 12.14,62.04 R18.2
N$39
  Top 0.305: C31.2 10.29,61.72 R18.1 | R17.1 R18.1 | R18.1 R19.1
N$40  (via drill 0.3)
  Top 0.254: IC1.13 44.59,6.79 R29.1 | R29.1 44.46,5.4 R28.2 | C43.1 2.67,45.72 v17.6,30.8 | v18.55,22.86 v18.55,29.84 | v19.5,21.91 19.5,17.14 21.09,15.56 21.09,12.38 v22.04,11.43 | v24.58,8.89 25.54,9.84 27.76,9.84 32.2,5.4 34.42,5.4 v35.38,6.35 | R29.1 v42.68,6.67
  Bottom 0.254: v18.55,29.84 v17.6,30.8 | v19.5,21.91 v18.55,22.86 | v24.58,8.89 v22.04,11.43 | v35.38,6.35 42.36,6.35 v42.68,6.67
N$41  (via drill 0.3)
  Top 0.254: IC1.6 39.51,16.38 R24.1 R23.2 39.51,17.78 37.92,19.37 v37.92,20.32 | v39.82,66.36 40.46,66.99 40.46,67.94 C44.1 | v39.82,63.5 37.28,63.5 31.88,58.1 31.57,58.1 29.98,56.52 v29.98,48.26 | v31.25,46.99 31.25,34.92 v33.79,32.38 | v35.06,31.11 35.06,30.16 36.33,28.89 v36.33,21.91
  Bottom 0.254: v39.82,63.5 v39.82,66.36 | v31.25,46.99 v29.98,48.26 | v35.06,31.11 v33.79,32.38 | v37.92,20.32 v36.33,21.91
N$42
  Top 0.254: IC1.2 44.59,16.38 C41.1 R20.1 44.46,18.48 R21.2 44.46,19.62 R22.2 R49.2
N$43  (via drill 0.3)
  Top 0.254: IC1.1 45.85,16.38 C41.2 R20.2 45.98,18.22 v46.17,18.41 | v37.92,18.41 37.92,17.97 R23.1
  Bottom 0.254: v46.17,18.41 45.54,17.78 38.55,17.78 v37.92,18.41
N$44
  Top 0.254: R30.2 R31.1 37.92,90.68 IC2.2
N$45
  Top 0.254: IC4.2 17.85,2.98 R52.1 R53.2
N$46
  Top 0.254: R28.1 44.27,3.17 | 44.27,3.17 44.27,2.35 C42.2 | R27.2 38.23,6.79 IC1.8 38.23,10.16 38.55,10.48 39.82,10.48 40.14,10.16 40.14,7.3 40.77,6.67 40.77,3.49 41.09,3.17 44.27,3.17
N$47  (via drill 0.3)
  Top 0.254: 39.98,3.02 39.63,3.37 R26.2 R25.2 R27.1 39.51,6.79 IC1.9 | 39.98,3.02 40.77,2.22 C42.1 | R50.2 14.3,1.59 34.42,1.59 v35.06,2.22 | v37.28,2.22 38.87,2.22 39.66,3.02 39.98,3.02
  Bottom 0.254: v35.06,2.22 v37.28,2.22
N$48
  Top 0.305: U$1.6 R59.2
N$49
  Top 0.254: U$9.TIP@3 7.44,10.53 7.44,6.03 12.52,0.95 35.06,0.95 36.33,2.22 36.33,4.13 37.28,5.08 R25.1
N$50
  Top 0.254: IC2.6 43,90.61 R33.1 C47.1 42.87,89.03 43.31,88.58 43.31,88.08 R32.2
N$51
  Top 0.305: IC2.13 37.92,100.46 R35.1 C48.1 R34.2
N$52
  Top 0.305: IC2.9 43,100.84 R36.2 43.12,102.3 R38.2 42.87,104.71 R37.2 44.9,104.78 46.17,103.5 R39.1
N$53  (via drill 0.3)
  Top 0.254: R39.2 46.17,100.01 44.33,98.17 IC2.8 45.28,97.16 v45.85,97.16 | Q5.B 48.56,94.44 v47.12,95.89
  Bottom 0.254: v47.12,95.89 v45.85,97.16
N$54  (via drill 0.3)
  Top 0.254: v43.63,103.5 44.9,103.5 45.22,103.19 45.22,102.87 45.54,102.55 48.4,102.55 50.62,100.33 50.62,90.49 Q5.C | v41.41,103.82 40.46,103.82 40.14,104.14 v38.87,104.14 | v34.11,104.14 33.47,104.14 31.57,102.23 27.76,102.23 25.54,104.46 21.41,104.46 20.45,103.5 R40.1
  Top 0.305: IC3.9 19.82,101.73 C49.1 20.01,103.25 R40.1
  Bottom 0.254: v43.63,103.5 41.73,103.5 v41.41,103.82 | v34.11,104.14 v38.87,104.14
N$55
  Top 0.254: R51.P$2 1.72,66.64 1.72,46.04 16.96,30.8 16.96,21.59 12.84,17.46 12.84,7.62 13.15,7.3 18.23,7.3 19.12,6.41 IC4.3
N$56
  Top 0.254: U$14.P$2 45.85,55.88 46.81,56.83 46.81,62.79 U$15.P$3
N$57
  Top 0.305: Q1.C 55.21,90.15 R42.1
N$58
  Top 0.305: IC3.8 21.09,101.47 C49.2 21.54,103.12 R41.1
N$59  (via drill 0.3)
  Top 0.254: R41.2 25.85,103.5 v29.66,99.69 | v30.61,98.74 31.25,98.74 33.16,96.84 v35.7,96.84 | v40.46,94.93 43.95,94.93 v44.27,95.25 | v45.22,94.3 45.22,93.03 48.4,89.85 Q5.E
  Top 0.305: Q1.E 52.52,89.54 51.89,88.9 49.2,88.9 Q5.E
  Bottom 0.254: v30.61,98.74 v29.66,99.69 | v35.7,96.84 38.55,96.84 v40.46,94.93 | v45.22,94.3 v44.27,95.25
N$60
  Top 0.254: U$13.TIP@3 29.98,15.05 R43.1
N$61  (via drill 0.3)
  Top 0.254: R43.2 28.27,17.08 R5.2 28.39,17.14 28.39,20.32 28.71,20.64 v28.71,25.4 | v27.76,26.35 27.76,30.16 27.12,30.8 v27.12,42.23 | v25.54,43.81 25.54,50.8 22.68,53.66 22.68,56.52 21.73,57.47 21.09,57.47 20.77,57.78 v20.77,68.26 | v20.77,70.17 20.77,79.06 v23,81.28 | v21.09,83.19 19.82,83.19 18.55,84.45 18.55,86.04 18.23,86.36 17.91,86.36 15.38,88.9 R44.2
  Top 0.305: IC3.3 16.01,91 R45.1 R44.2
  Bottom 0.254: v27.76,26.35 v28.71,25.4 | v25.54,43.81 v27.12,42.23 | v20.77,70.17 v20.77,68.26 | v21.09,83.19 v23,81.28
N$62
  Top 0.254: Q2.B 17.6,85.41 14.74,88.27 14.74,89.85 14.11,90.49 R45.2
  Top 0.305: IC3.1 13.47,91 R45.2
N$63
  Top 0.305: IC3.5 18.55,93.34 19.18,92.71 19.5,92.71 19.82,92.39 19.82,91 19.73,90.9 | 19.73,90.9 R46.1 18.87,87.78 Q2.C | C50.1 20.58,90.04 19.73,90.9
N$64  (via drill 0.3)
  Top 0.254: v29.66,68.26 R48.1 | v27.76,70.17 26.8,70.17 23.63,73.34 v23.63,81.92 | v22.36,83.19 22.36,85.09 Q3.C
  Bottom 0.254: v27.76,70.17 v29.66,68.26 | v22.36,83.19 v23.63,81.92
N$65
  Top 0.305: IC3.7 C50.2 R47.1
N$66
  Top 0.305: R47.2 22.68,88.66 Q3.E 19.5,85.49 Q2.E
N$67
  Top 0.254: U$11.TIP@3 R55.2
N$68
  Top 0.305: R54.2 53.86,103.31 U$10.TIP@3
N$69  (via drill 0.3)
  Top 0.254: IC4.7 17.85,12.57 R56.2 C55.2 17.6,14.61 16.96,15.24 16.96,20.95 17.6,21.59 17.6,29.84 v21.73,33.97 | v44.9,46.35 51.25,52.7 R58.1 | v41.09,42.55 41.09,40.64 v33.79,33.34 | v32.84,32.38 31.57,31.11 v28.39,31.11 | v24.27,32.7 v27.12,29.84
  Bottom 0.254: v41.09,42.55 v44.9,46.35 | v32.84,32.38 v33.79,33.34 | v27.12,29.84 v28.39,31.11 | v24.27,32.7 23,32.7 v21.73,33.97
N$70
  Top 0.254: R58.2 U$16.TIP@3
N$71  (via drill 0.3)
  Top 0.254: v24.9,50.48 19.5,45.09 19.5,38.73 22.36,35.88 22.36,33.66 21.09,32.38 21.09,24.45 17.91,21.27 17.91,16.19 R57.1 | v25.85,51.44 25.85,53.98 v32.52,60.64 | v34.42,58.74 36.33,58.74 36.97,58.1 38.23,58.1 v42.36,62.23 | v43.95,63.82 46.17,66.04 U$15.P$2
  Bottom 0.254: v25.85,51.44 v24.9,50.48 | v34.42,58.74 v32.52,60.64 | v43.95,63.82 v42.36,62.23
N$72
  Top 0.305: IC3.13 14.74,101.92 | 14.74,101.92 R156.1 | R157.2 6.68,40.13 1.09,45.72 1.09,94.3 10.93,104.14 13.79,104.14 14.74,103.19 14.74,101.92
N$73
  Top 0.254: IC4.6 R56.1 C55.1 19.12,16 R57.2
N$78  (via drill 0.3)
  Top 0.254: IC3.12 16.01,98.74 14.42,97.16 12.2,97.16 10.93,95.89 4.26,95.89 3.63,95.25 3.63,85.72 10.93,78.42 v10.93,71.12 | v11.88,70.17 15.38,70.17 17.91,67.63 18.87,67.63 19.18,67.31 19.18,49.53 19.5,49.21 19.5,46.04 v17.28,43.81 | v16.01,34.29 v16.01,42.55 | v13.79,32.07 13.79,32.38 12.84,33.34 10.61,33.34 9.66,32.38 R142.P$2
  Bottom 0.254: v11.88,70.17 v10.93,71.12 | v16.01,42.55 v17.28,43.81 | v13.79,32.07 v16.01,34.29
OUT_1
  Top 0.254: 40.77,87.63 C22.2 R32.1
OUT_2
  Top 0.254: R34.1 34.74,103.82 26.17,95.25 26.17,85.41 7.12,66.36 3.95,66.36 2.67,65.09 2.67,59.05 3.95,57.78 6.99,57.78 C29.2
OUTPOST1  (via drill 0.3)
  Top 0.254: R54.1 47.44,97.47 44.27,94.3 IC2.7 44.27,90.61 R33.2 C47.2 44.59,89.22 v47.12,86.68 | R53.1 22.68,2.86 23.95,4.13 23.95,25.08 23,26.04 23,40.32 41.09,58.42 44.26,58.42 U$14.P$3 44.27,58.49 44.27,61.28 41.41,64.14 41.09,64.14 | v14.74,72.39 17.6,69.53 30.61,69.53 36.01,64.14 41.09,64.14 | v48.4,85.41 48.4,75.25 42.68,69.53 42.68,67.31 v41.09,65.72 | 41.09,64.14 v41.09,64.45
  Bottom 0.254: R51.P$3 12.55,74.58 v14.74,72.39 | v48.4,85.41 v47.12,86.68 | v41.09,64.45 v41.09,65.72
OUTPOST2  (via drill 0.3)
  Top 0.254: R55.1 55.83,15.05 58.24,17.46 58.24,37.78 56.33,39.69 46.17,39.69 44.27,41.59 44.27,47.62 | 44.27,47.62 44.27,53.27 U$14.P$1 | 36.33,100.65 36.33,102.23 C48.2 v34.11,102.23 | 36.33,100.65 36.33,98.74 36.65,98.42 IC2.14 | 36.33,100.65 R35.2 | v30.61,105.09 18.23,105.09 v17.91,104.78 | v16.96,105.73 11.88,105.73 0.45,94.3 0.45,40.96 6.49,34.92 R157.1 | v43,47.62 44.27,47.62 | v41.09,47.62 30.93,47.62 23.63,40.32 v23.63,40.01 | v22.36,36.83 v22.36,38.73 | v21.41,35.88 19.82,34.29 v16.96,34.29 | v14.74,32.07 12.84,33.97 7.08,33.97
  Top 0.305: R142.P$3 7.08,33.97 7.08,34.39 R157.1
  Bottom 0.254: v34.11,102.23 31.25,105.09 v30.61,105.09 | v16.96,105.73 v17.91,104.78 | v41.09,47.62 v43,47.62 | v22.36,38.73 v23.63,40.01 | v21.41,35.88 v22.36,36.83 | v14.74,32.07 v16.96,34.29